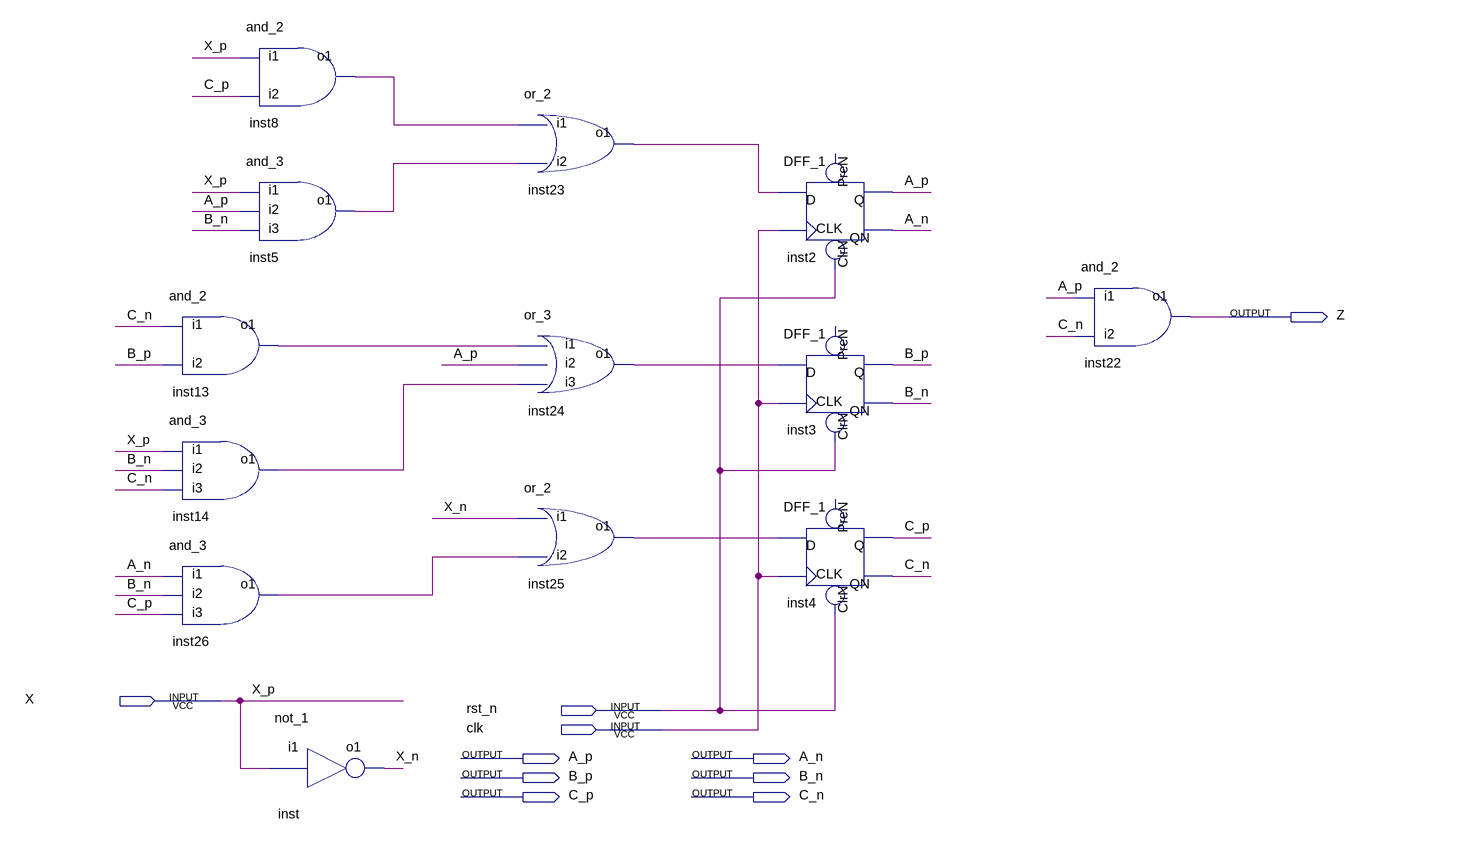
[diagram p0: schematic sheet]
// Quartus schematic SD.bdf as structural Verilog: 13 symbols, 10 pins
module SD (
  input  X,
  input  rst_n,
  input  clk,
  output Z,
  output A_p,
  output A_n,
  output B_p,
  output B_n,
  output C_p,
  output C_n
);

  wire inst5_o1, inst8_o1, inst13_o1, inst14_o1, inst23_o1, inst24_o1, inst25_o1, inst26_o1, X_n;

  and_2 inst13 (.i1(C_n), .i2(B_p), .o1(inst13_o1));
  and_3 inst14 (.i1(X), .i2(B_n), .i3(C_n), .o1(inst14_o1));
  and_3 inst26 (.i1(A_n), .i2(B_n), .i3(C_p), .o1(inst26_o1));
  and_2 inst8 (.i1(X), .i2(C_p), .o1(inst8_o1));
  and_3 inst5 (.i1(X), .i2(A_p), .i3(B_n), .o1(inst5_o1));
  not_1 inst (.i1(X), .o1(X_n));
  or_2 inst23 (.i1(inst8_o1), .i2(inst5_o1), .o1(inst23_o1));
  or_3 inst24 (.i1(inst13_o1), .i2(A_p), .i3(inst14_o1), .o1(inst24_o1));
  or_2 inst25 (.i1(X_n), .i2(inst26_o1), .o1(inst25_o1));
  DFF_1 inst2 (.CLK(clk), .D(inst23_o1), .ClrN(rst_n), .QN(A_n), .Q(A_p));  // open: PreN
  DFF_1 inst3 (.CLK(clk), .D(inst24_o1), .ClrN(rst_n), .QN(B_n), .Q(B_p));  // open: PreN
  DFF_1 inst4 (.CLK(clk), .D(inst25_o1), .ClrN(rst_n), .QN(C_n), .Q(C_p));  // open: PreN
  and_2 inst22 (.i1(A_p), .i2(C_n), .o1(Z));

  // Other names for the same wires on the sheet: X_p = X
endmodule
